# EAGLE design C64_Exp_cartridge (EAGLE 9.6.0)
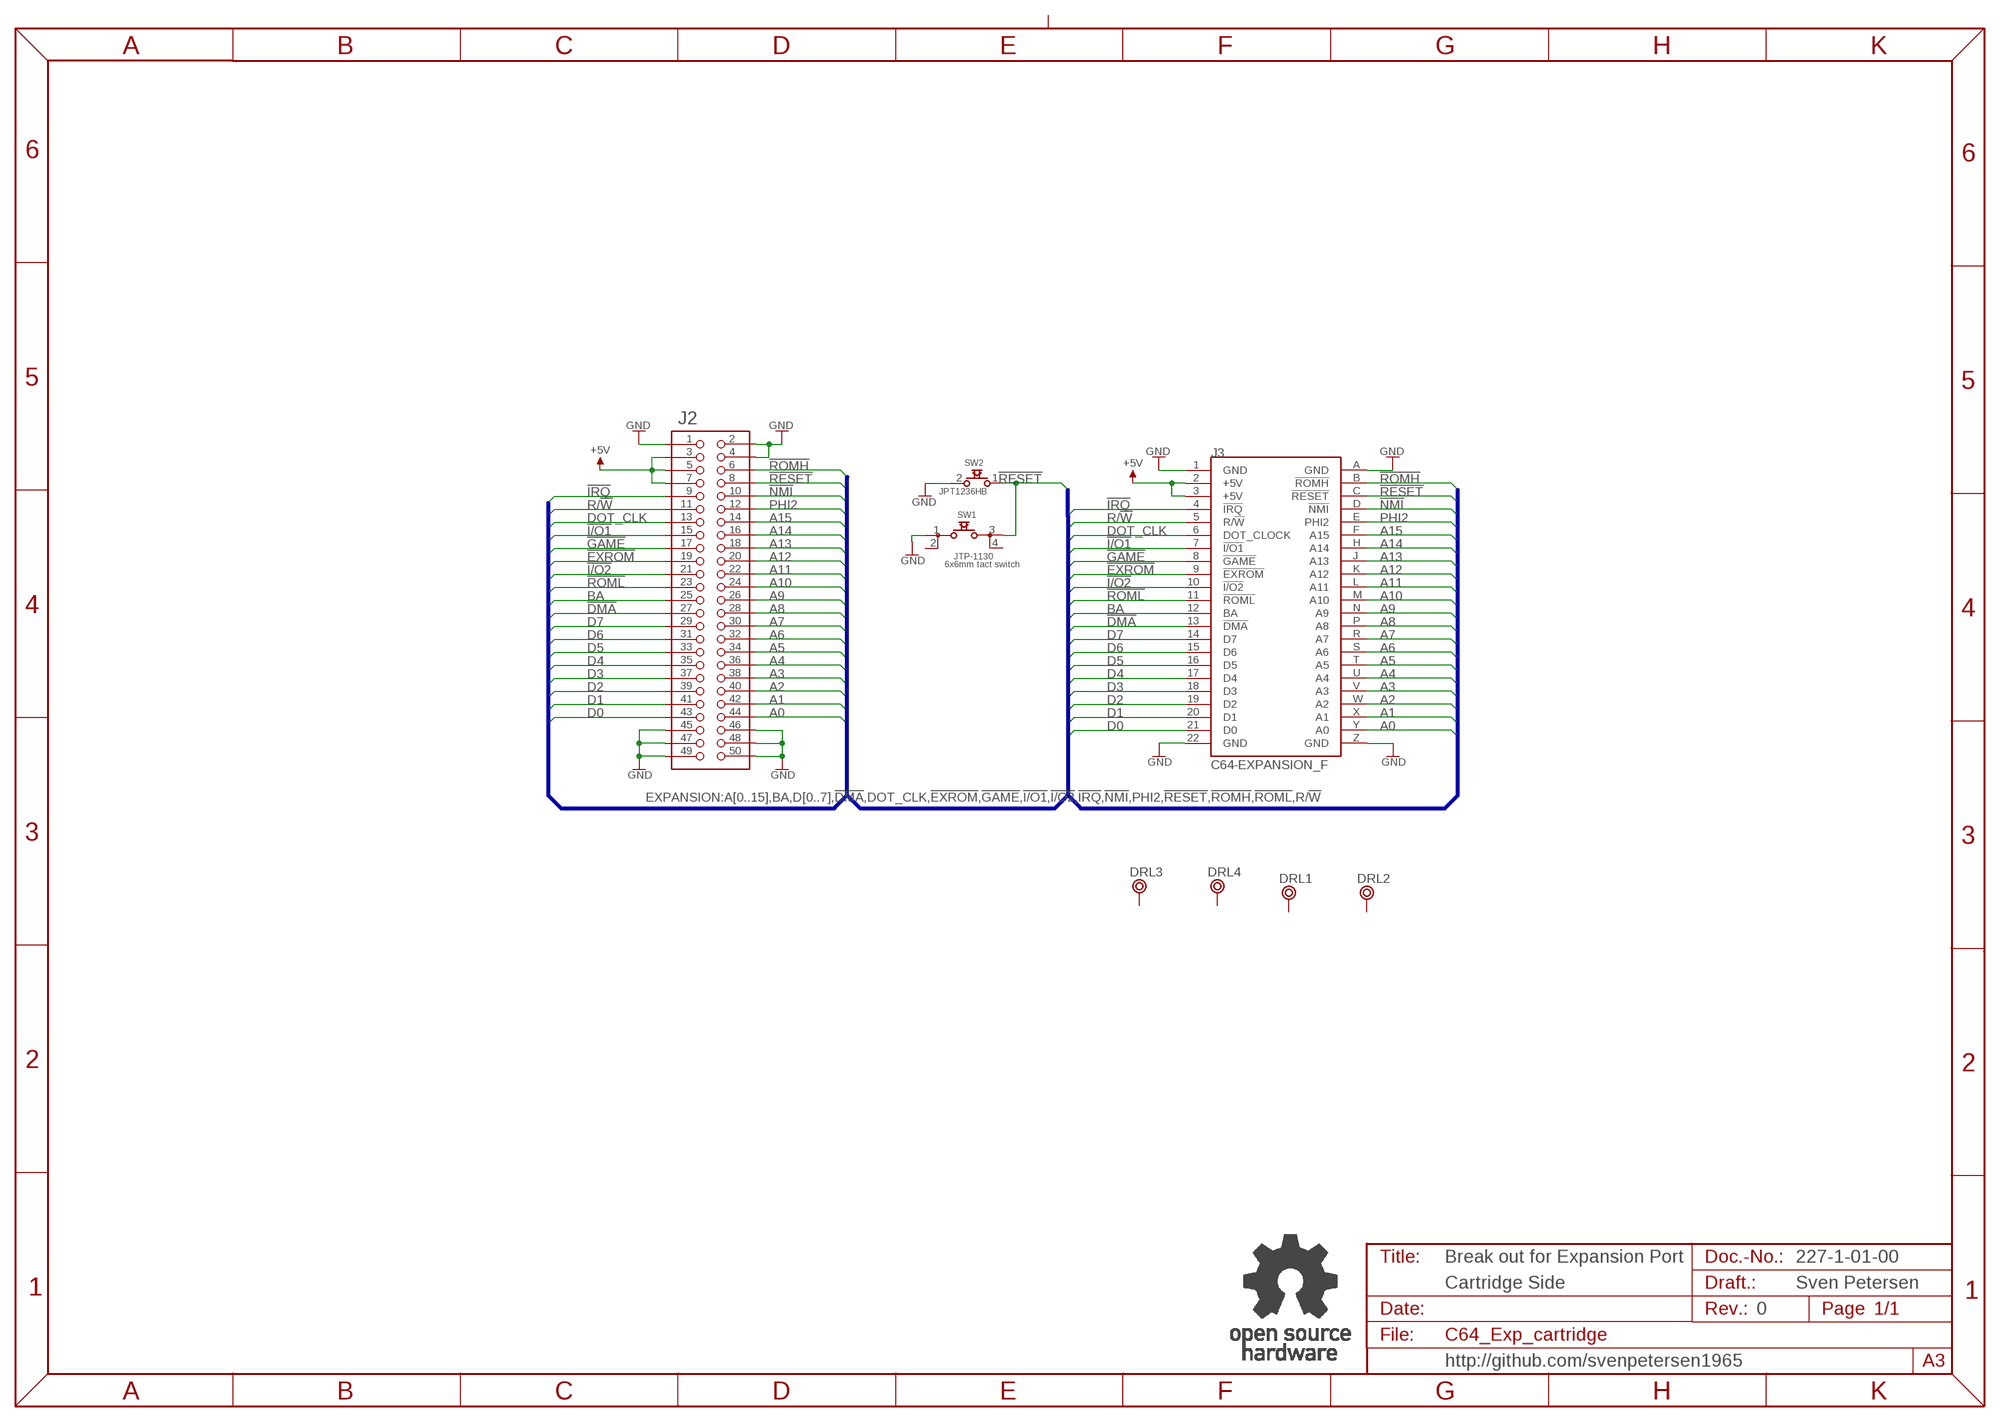
[diagram p0: schematic, sheet 1]

## Parts
DRL1  BOHR3,3  [BOHR3,3]
DRL2  BOHR3,3  [BOHR3,3]
DRL3  BOHR3,3  [BOHR3,3]
DRL4  BOHR3,3  [BOHR3,3]
J2  PINHD-2X25BOX  [2X25WV]
J3  C64-EXPANSION_F  [EXPANSION_OUT]
SW1  JTP-1130  [JTP-1130]
SW2  JPT1236HB  [JTP_1236HB]
U$22  OPEN_SOURCE_HW  [OPENHW]

## Nets
!DMA: J2.27 J3.13(!DMA)
!EXROM: J2.19 J3.9(!EXROM)
!GAME: J2.17 J3.8(!GAME)
!I/O1: J2.15 J3.7(!I/O1)
!I/O2: J2.21 J3.10(!I/O2)
!IRQ: J2.9 J3.4(!IRQ)
!NMI: J2.10 J3.D(!NMI)
!RESET: J2.8 J3.C(!RESET) SW1.3 SW2.1
!ROMH: J2.6 J3.B(!ROMH)
!ROML: J2.23 J3.11(!ROML)
+5V: J2.3 J2.5 J2.7 J3.2(+5V) J3.3(+5V)
A0: J2.44 J3.Y(A0)
A1: J2.42 J3.X(A1)
A2: J2.40 J3.W(A2)
A3: J2.38 J3.V(A3)
A4: J2.36 J3.U(A4)
A5: J2.34 J3.T(A5)
A6: J2.32 J3.S(A6)
A7: J2.30 J3.R(A7)
A8: J2.28 J3.P(A8)
A9: J2.26 J3.N(A9)
A10: J2.24 J3.M(A10)
A11: J2.22 J3.L(A11)
A12: J2.20 J3.K(A12)
A13: J2.18 J3.J(A13)
A14: J2.16 J3.H(A14)
A15: J2.14 J3.F(A15)
BA: J2.25 J3.12(BA)
D0: J2.43 J3.21(D0)
D1: J2.41 J3.20(D1)
D2: J2.39 J3.19(D2)
D3: J2.37 J3.18(D3)
D4: J2.35 J3.17(D4)
D5: J2.33 J3.16(D5)
D6: J2.31 J3.15(D6)
D7: J2.29 J3.14(D7)
DOT_CLK: J2.13 J3.6(DOT_CLOCK)
GND: J2.1 J2.2 J2.4 J2.45 J2.46 J2.47 J2.48 J2.49 J2.50 J3.1(GND) J3.22(GND) J3.A(GND) J3.Z(GND) SW1.1 SW2.2
PHI2: J2.12 J3.E(PHI2)
R/!W: J2.11 J3.5(R/!W)
Unconnected: DRL1.P$1 DRL2.P$1 DRL3.P$1 DRL4.P$1 SW1.2 SW1.4

## Buses
EXPANSION:A[0..15],BA,D[0..7],!DMA,DOT_CLK,!EXROM,!GAME,!I/O1,!I/O2,!IRQ,!NMI,PHI2,!RESET,!ROMH,!ROML,R/!W

## Notes on the sheet
- 6x6mm tact switch
- Break out for Expansion Port | 227-1-01-00
- Cartridge Side | Sven Petersen
- 0
- http://github.com/svenpetersen1965

## Library data of the parts
DRL1-DRL4 = Mech_Bohr:BOHR3,3
J2 = PINHEAD:PINHD-2X25
J3 = Commodore:C64-EXPANSION_F
SW1 = Namae_Electronics:JTP-1130
SW2 = Namae_Electronics:JPT1236HB
U$22 = Logo:OPEN_SOURCE_HW

## Board
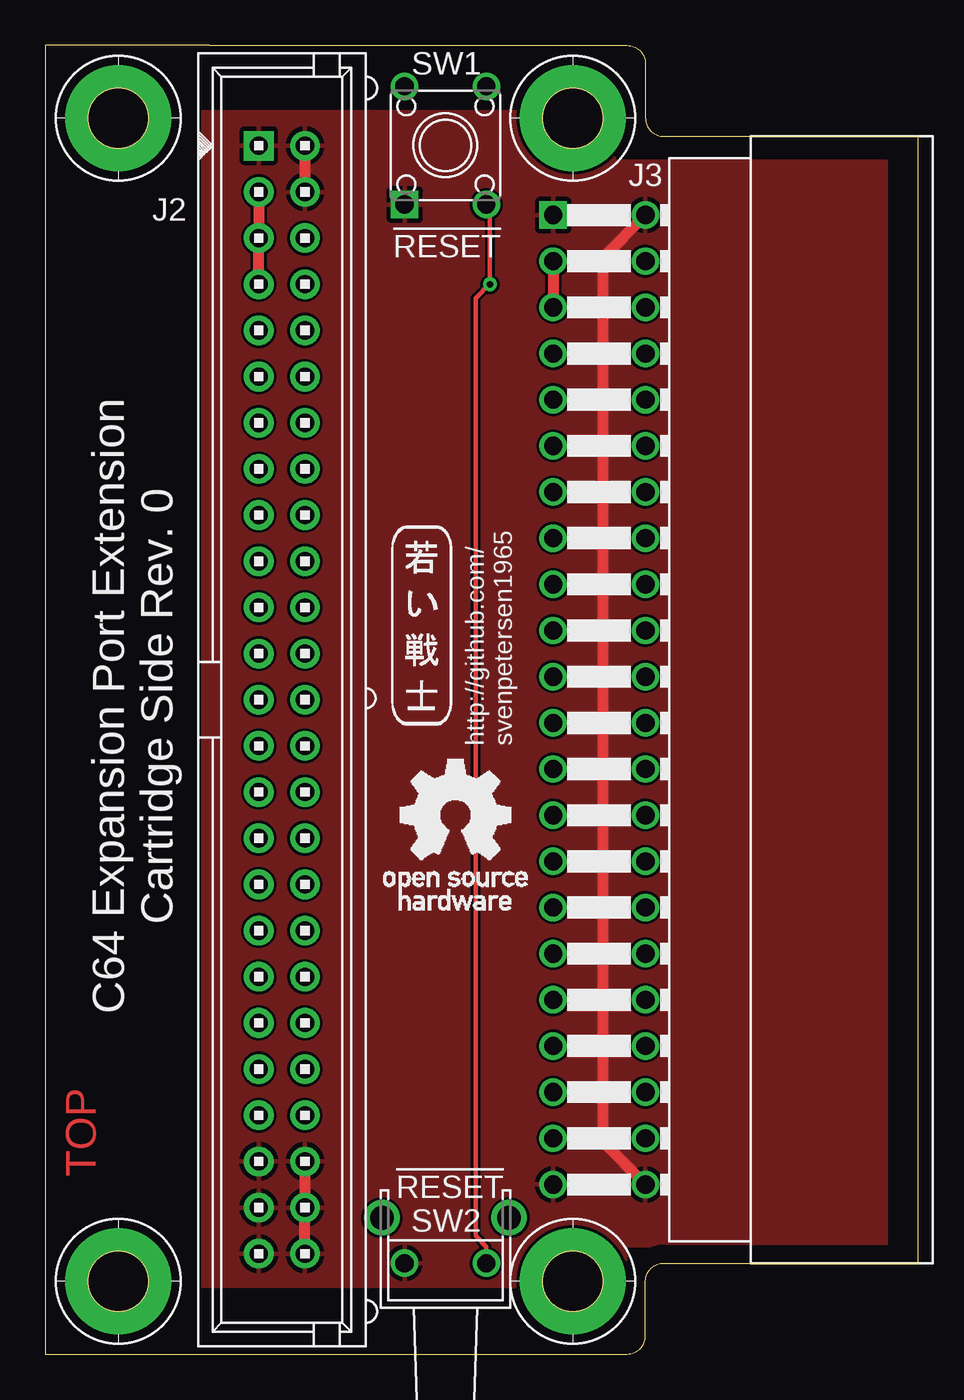
[diagram p1: board, top side]
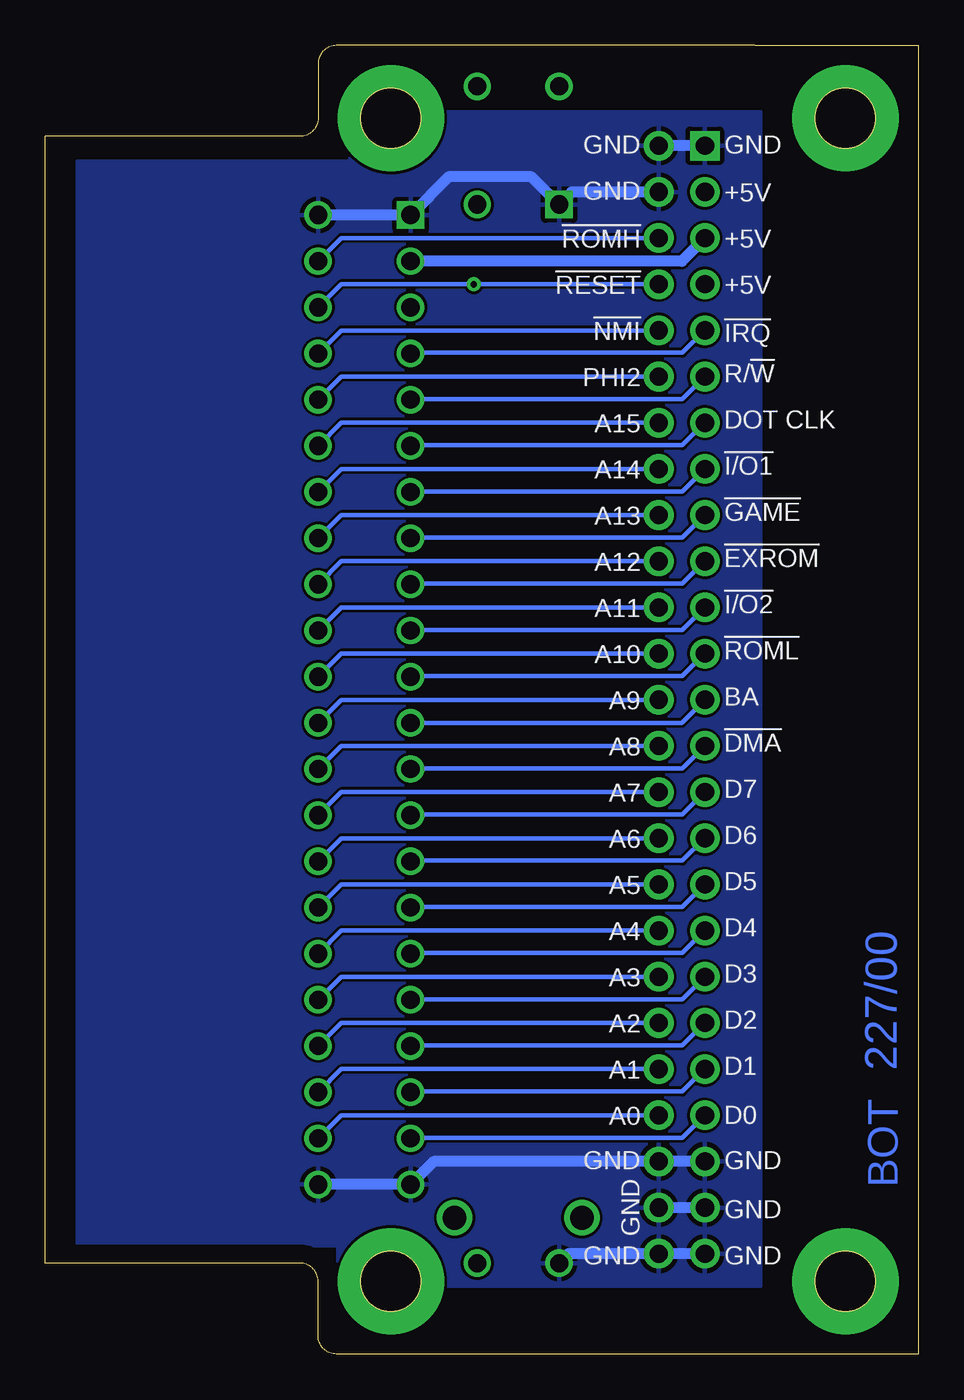
[diagram p2: board, bottom side, seen from below]

Size 48 x 72 mm. Coordinates in mm from the lower left corner, seen from the top.
Outline: 9,72 32,72 arc-90 33,71 33,68 arc90 34,67 48,67 48,5 34,5 arc90 33,4 33,1 arc-90 32,0 9,0 0,0 0,72 9,72
Copper layers (1*16): Top 0.035mm / dielectric 1.5mm / Bottom 0.035mm
Design rules "default *": minimum track width 6mil, minimum drill 0.35mm, track to track 6mil, track to pad 6mil, pad to pad 6mil, via to via 6mil, smd to smd 6mil, copper to edge 40mil, drill to drill 6mil, minimum pad ring 10mil, minimum via ring 8mil, stop-mask expansion 4mil, vias tented up to drill 25mil, thermal gap 10mil

### Footprints (pad centres in the part's own frame; a part is rotated, then mirrored left to right if it is on the bottom)
BOHR3,3 = drill 3.302 pad 5.842: P$1 0,0
2X25WV = drill 1 pad 1.626 square: 1 -30.48,-1.27 | drill 1 pad 1.626: 2 -30.48,1.27; 3 -27.94,-1.27; 4 -27.94,1.27; 5 -25.4,-1.27; 6 -25.4,1.27; 7 -22.86,-1.27; 8 -22.86,1.27; 9 -20.32,-1.27; 10 -20.32,1.27; 11 -17.78,-1.27; 12 -17.78,1.27; 13 -15.24,-1.27; 14 -15.24,1.27; 15 -12.7,-1.27; 16 -12.7,1.27; 17 -10.16,-1.27; 18 -10.16,1.27; 19 -7.62,-1.27; 20 -7.62,1.27; 21 -5.08,-1.27; 22 -5.08,1.27; 23 -2.54,-1.27; 24 -2.54,1.27; 25 0,-1.27; 26 0,1.27; 27 2.54,-1.27; 28 2.54,1.27; 29 5.08,-1.27; 30 5.08,1.27; 31 7.62,-1.27; 32 7.62,1.27; 33 10.16,-1.27; 34 10.16,1.27; 35 12.7,-1.27; 36 12.7,1.27; 37 15.24,-1.27; 38 15.24,1.27; 39 17.78,-1.27; 40 17.78,1.27; 41 20.32,-1.27; 42 20.32,1.27; 43 22.86,-1.27; 44 22.86,1.27; 45 25.4,-1.27; 46 25.4,1.27; 47 27.94,-1.27; 48 27.94,1.27; 49 30.48,-1.27; 50 30.48,1.27
EXPANSION_OUT = drill 1 square: 1 -5.08,26.67 | drill 1: 2 -5.08,24.13; 3 -5.08,21.59; 4 -5.08,19.05; 5 -5.08,16.51; 6 -5.08,13.97; 7 -5.08,11.43; 8 -5.08,8.89; 9 -5.08,6.35; 10 -5.08,3.81; 11 -5.08,1.27; 12 -5.08,-1.27; 13 -5.08,-3.81; 14 -5.08,-6.35; 15 -5.08,-8.89; 16 -5.08,-11.43; 17 -5.08,-13.97; 18 -5.08,-16.51; 19 -5.08,-19.05; 20 -5.08,-21.59; 21 -5.08,-24.13; 22 -5.08,-26.67; A 0,26.67; B 0,24.13; C 0,21.59; D 0,19.05; E 0,16.51; F 0,13.97; H 0,11.43; J 0,8.89; K 0,6.35; L 0,3.81; M 0,1.27; N 0,-1.27; P 0,-3.81; R 0,-6.35; S 0,-8.89; T 0,-11.43; U 0,-13.97; V 0,-16.51; W 0,-19.05; X 0,-21.59; Y 0,-24.13; Z 0,-26.67
JTP-1130 = drill 1 square: 1 3.25,-2.25 | drill 1: 2 -3.25,-2.25; 3 3.25,2.25; 4 -3.25,2.25
JTP_1236HB = drill 1: 1 2.25,0; 2 -2.25,0 | drill 1.3: CS1 3.5,2.5; CS2 -3.5,2.5

### Placement (x,y rotation side)
DRL1  29,68 0 top
DRL2  29,4 0 top
DRL3  4,4 0 top
DRL4  4,68 0 top
J2  13,36 270 top
J3  33,36 0 top
SW1  22,66.5 270 top
SW2  22,5 0 top
U$20  [2LAYER]  2.78,9.76 90 top
U$21  [PCB-TITLE/]  0,83.74 0 top  (outside the outline)
U$22  18.61,24.43 0 top
U$23  [SVEN_TAG]  20.73,40.21 0 top

### Tracks (layer width: path | path; a pad name or v marks a point on that pad's centre or on a via)
!DMA
  Bottom 0.254: J2.27 12.96,32.23 27.88,32.23 J3.13
!EXROM
  Bottom 0.254: J2.19 12.96,42.39 27.88,42.39 J3.9
!GAME
  Bottom 0.254: J2.17 12.96,44.93 27.88,44.93 J3.8
!I/O1
  Bottom 0.254: J2.15 12.96,47.47 27.88,47.47 J3.7
!I/O2
  Bottom 0.254: J2.21 12.96,39.85 27.88,39.85 J3.10
!IRQ
  Bottom 0.254: J2.9 12.96,55.09 27.88,55.09 J3.4
!NMI
  Bottom 0.254: J2.10 31.73,56.32 J3.D
!RESET  (via drill 0.35)
  Top 0.254: SW2.1 24.25,5.91 23.65,6.51 23.65,58.1 24.45,58.9 | 24.45,58.9 v24.45,58.86 | SW1.3 24.45,63.05 24.45,58.9
  Bottom 0.254: J2.8 v24.45,58.86 31.73,58.86 J3.C
!ROMH
  Bottom 0.254: J2.6 31.73,61.4 J3.B
!ROML
  Bottom 0.254: J2.23 12.96,37.31 27.88,37.31 J3.11
+5V
  Top 0.61: J2.3 J2.5 J2.7 | J3.2 J3.3
  Bottom 0.61: J2.5 13,60.13 J3.2
A0
  Bottom 0.254: J2.44 31.73,13.14 J3.Y
A1
  Bottom 0.254: J2.42 31.73,15.68 J3.X
A2
  Bottom 0.254: J2.40 31.73,18.22 J3.W
A3
  Bottom 0.254: J2.38 31.73,20.76 J3.V
A4
  Bottom 0.254: J2.36 31.73,23.3 J3.U
A5
  Bottom 0.254: J2.34 31.73,25.84 J3.T
A6
  Bottom 0.254: J2.32 31.73,28.38 J3.S
A7
  Bottom 0.254: J2.30 31.73,30.92 J3.R
A8
  Bottom 0.254: J2.28 31.73,33.46 J3.P
A9
  Bottom 0.254: J2.26 31.73,36 J3.N
A10
  Bottom 0.254: J2.24 31.73,38.54 J3.M
A11
  Bottom 0.254: J2.22 31.73,41.08 J3.L
A12
  Bottom 0.254: J2.20 31.73,43.62 J3.K
A13
  Bottom 0.254: J2.18 31.73,46.16 J3.J
A14
  Bottom 0.254: J2.16 31.73,48.7 J3.H
A15
  Bottom 0.254: J2.14 31.73,51.24 J3.F
BA
  Bottom 0.254: J2.25 13,34.73 J3.12
D0
  Bottom 0.254: J2.43 12.96,11.91 27.88,11.91 J3.21
D1
  Bottom 0.254: J2.41 12.96,14.45 27.88,14.45 J3.20
D2
  Bottom 0.254: J2.39 12.96,16.99 27.88,16.99 J3.19
D3
  Bottom 0.254: J2.37 12.96,19.53 27.88,19.53 J3.18
D4
  Bottom 0.254: J2.35 12.96,22.07 27.88,22.07 J3.17
D5
  Bottom 0.254: J2.33 12.96,24.61 27.88,24.61 J3.16
D6
  Bottom 0.254: J2.31 12.96,27.15 27.88,27.15 J3.15
D7
  Bottom 0.254: J2.29 12.96,29.69 27.88,29.69 J3.14
DOT_CLK
  Bottom 0.254: J2.13 12.96,50.01 27.88,50.01 J3.6
GND
  Top 0.61: J2.2 J2.4 | J2.46 J2.48 J2.50 | J3.A 30.64,60.31 30.64,11.69 J3.Z
  Bottom 0.61: J2.1 J2.2 | J3.A J3.1 25.82,64.77 21.27,64.77 SW1.1 19.06,63.94 J2.4 | J2.47 J2.48 | J2.49 J2.50 19.23,5.52 SW2.2 | J2.45 J2.46 26.65,10.6 J3.22 J3.Z
  pour Bottom: 8.66,3.73 8.66,68.34 31.28,68.34 31.28,65.64 46.25,65.64 46.25,5.95 31.91,5.95 31.91,4.05 31.59,3.73
  pour Top: 8.66,3.73 8.66,68.34 31.28,68.34 31.28,65.64 46.25,65.64 46.25,5.95 31.91,5.95 31.91,4.05 31.59,3.73
PHI2
  Bottom 0.254: J2.12 31.73,53.78 J3.E
R/!W
  Bottom 0.254: J2.11 12.96,52.55 27.88,52.55 J3.5

### Text on the board
Bottom: 227/00
tPlace: !RESET | C64 Expansion Port Extension / Cartridge Side Rev. 0 | http://github.com/ / svenpetersen1965 | !RESET
bPlace: GND | GND | +5V | GND | +5V | !ROMH | +5V | !RESET | !IRQ | !NMI | R/!W | PHI2 | DOT CLK | A15 | !I/O1 | A14 | !GAME | A13 | !EXROM | A12 | !I/O2 | A11 | !ROML | A10 | BA | A9 | !DMA | A8 | D7 | A7 | D6 | A6 | D5 | A5 | D4 | A4 | D3 | A3 | D2 | A2 | D1 | A1 | D0 | A0 | GND | GND | GND | GND | GND | GND
Document: Sven Petersen | 227-2-01-00 | 2026 | 35µm | 2 | 0